# Altium schematic sheet J-Link ARM-OB.SchDoc
size A4; DocumentNumber: 2; SheetNumber: 2; SheetTotal: 2
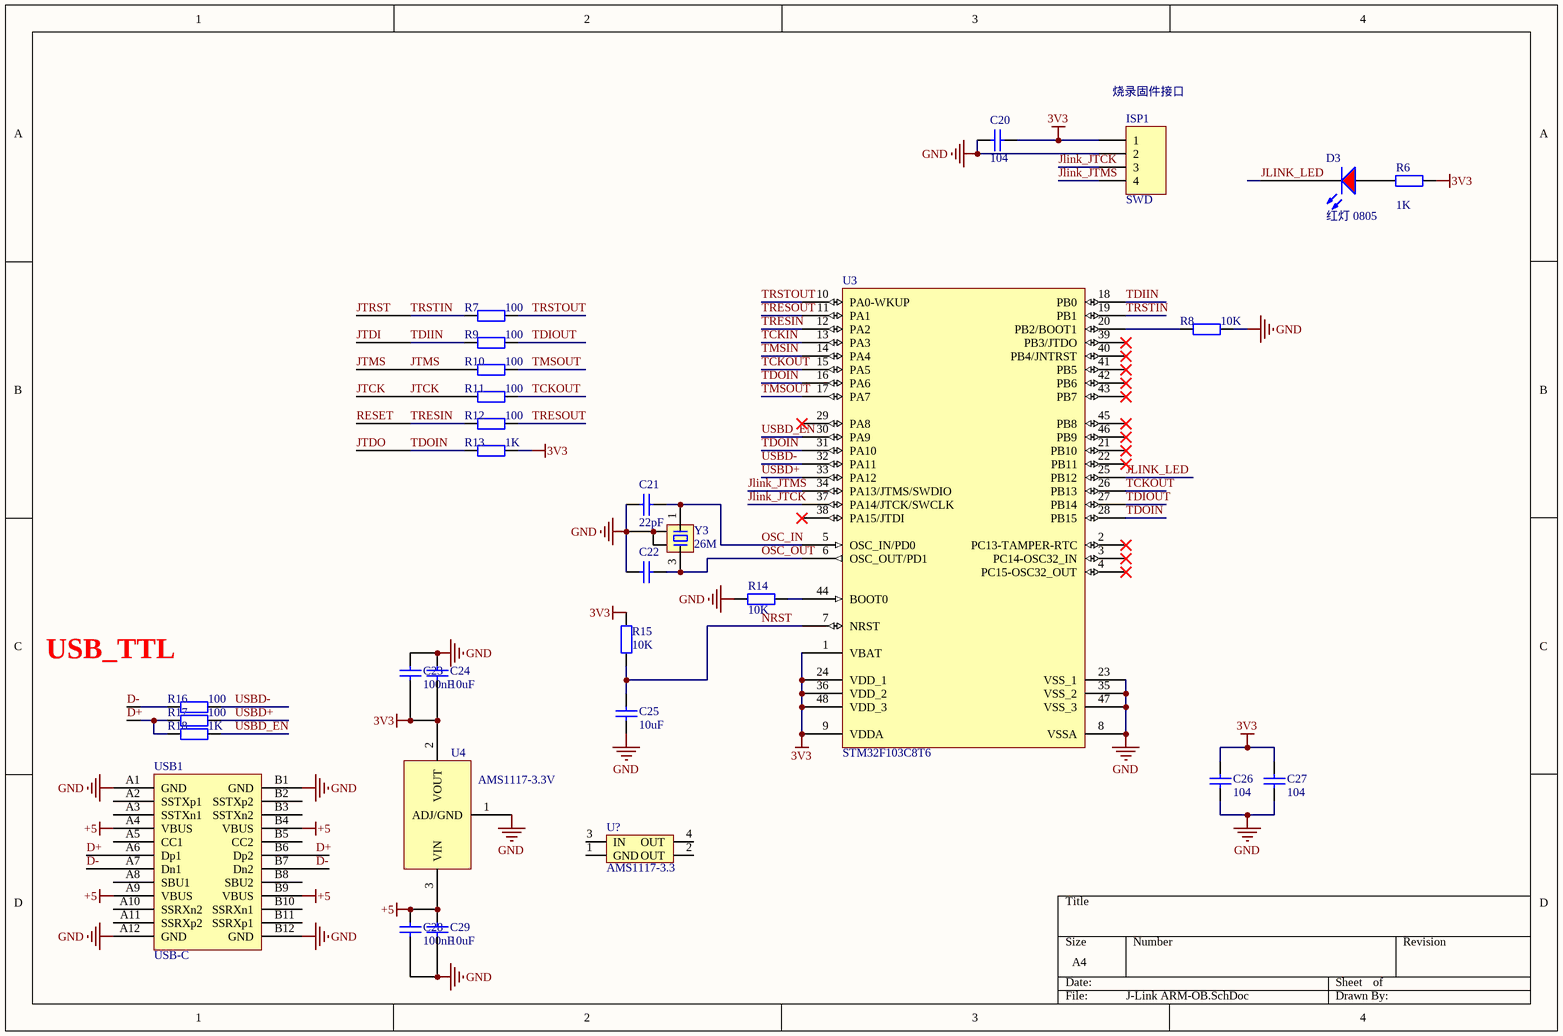
[diagram p0: J-Link ARM-OB.SchDoc]

## Parts
C20  value 104  [LC-0805_C]
C21  value 22pF  [LC-0805_C]
C22  (no value)  [LC-0805_C]
C23  100nF  [LC-0805_C]
C24  10uF  [LC-0805_C]
C25  value 10uF  [LC-0805_C]
C26  value 104  [LC-0805_C]
C27  value 104  [LC-0805_C]
C28  100nF  [LC-0805_C]
C29  10uF  [LC-0805_C]
D3  红灯 0805  [LC-0805_LED_S1]
ISP1  SWD  [HDR1X4]
R6  value 1K  [LC-0805_L]
R7  value 100  [LC-0805_L]
R8  value 10K  [LC-0805_L]
R9  value 100  [LC-0805_L]
R10  value 100  [LC-0805_L]
R11  value 100  [LC-0805_L]
R12  value 100  [LC-0805_L]
R13  value 1K  [LC-0805_L]
R14  value 10K  [LC-0805_L]
R15  value 10K  [LC-0805_L]
R16  value 100  [LC-0805_L]
R17  value 100  [LC-0805_L]
R18  value 1K  [LC-0805_L]
U3  STM32F103C8T6  [LQFP48 7X7_N]
U4  AMS1117-3.3V  [SOT-223]
U?  AMS1117-3.3  [AMS1117]
USB1  USB-C  [USB-C/S_A]
Y3  26M  [XTAL-3225]

## Nets
3V3: C20.2 C23.1 C24.1 C26.1 C27.1 ISP1.1 R6.2 R13.2 R15.2 U3.1(VBAT) U3.9(VDDA) U3.24(VDD_1) U3.36(VDD_2) U3.48(VDD_3) U4.2(VOUT)
+5: C28.2 C29.2 U4.3(VIN) USB1.A4(VBUS) USB1.A9(VBUS) USB1.B4(VBUS) USB1.B9(VBUS)
GND: C20.1 C21.2 C22.2 C23.2 C24.2 C25.2 C26.2 C27.2 C28.1 C29.1 ISP1.2 R8.2 R14.1 U3.8(VSSA) U3.23(VSS_1) U3.35(VSS_2) U3.47(VSS_3) U4.1(ADJ/GND) USB1.A1(GND) USB1.A12(GND) USB1.B1(GND) USB1.B12(GND) Y3.2 Y3.4
D+: R17.1 R18.1 USB1.A6(Dp1) USB1.B6(Dp2)
D-: R16.1 USB1.A7(Dn1) USB1.B7(Dn2)
Jlink_JTCK: ISP1.3 U3.37(PA14/JTCK/SWCLK)
Jlink_JTMS: ISP1.4 U3.34(PA13/JTMS/SWDIO)
JLINK_LED: D3.K U3.25(PB12)
JTCK: R11.1
JTDI: R9.1 U3.18(PB0)  [also labelled TDIIN]
JTDO: R13.1 U3.16(PA6) U3.28(PB15) U3.31(PA10)  [also labelled TDOIN]
JTMS: R10.1
JTRST: R7.1 U3.19(PB1)  [also labelled TRSTIN]
NRST: C25.1 R15.1 U3.7(NRST)
OSC_IN: C21.1 U3.5(OSC_IN/PD0) Y3.1
OSC_OUT: C22.1 U3.6(OSC_OUT/PD1) Y3.3
RESET: R12.1 U3.12(PA2)  [also labelled TRESIN]
TCKIN: U3.13(PA3)
TCKOUT: R11.2 U3.15(PA5) U3.26(PB13)
TDIOUT: R9.2 U3.27(PB14)
TMSIN: U3.14(PA4)
TMSOUT: R10.2 U3.17(PA7)
TRESOUT: R12.2 U3.11(PA1)
TRSTOUT: R7.2 U3.10(PA0-WKUP)
USBD+: R17.2 U3.33(PA12)
USBD-: R16.2 U3.32(PA11)
USBD_EN: R18.2 U3.30(PA9)
NetD3_A: D3.A R6.1
NetR8_1: R8.1 U3.20(PB2/BOOT1)
NetR14_2: R14.2 U3.44(BOOT0)

Not connected (* = marked no-connect by the designer): U3 2(PC13-TAMPER-RTC)* 3(PC14-OSC32_IN)* 4(PC15-OSC32_OUT)* 21(PB10)* 22(PB11)* 29(PA8)* 38(PA15/JTDI)* 39(PB3/JTDO)* 40(PB4/JNTRST)* 41(PB5)* 42(PB6)* 43(PB7)* 45(PB8)* 46(PB9)*; U? 1(GND) 2(OUT) 3(IN) 4(OUT); USB1 A2(SSTXp1) A3(SSTXn1) A5(CC1) A8(SBU1) A10(SSRXn2) A11(SSRXp2) B2(SSTXp2) B3(SSTXn2) B5(CC2) B8(SBU2) B10(SSRXn1) B11(SSRXp1)

## Notes on the sheet
- (near ISP1) 烧录固件接口
- USB_TTL

## Library data of the parts
C20-C22 C25-C27 = Cap: Capacitor; Published: 8-Jun-2000; LatestRevisionDate: 17-Jul-2002; LatestRevisionNote: Re-released for DXP Platform.; PackageReference: RAD-0.3; Publisher: Altium Limited
C23 C28 = 0805 100nF(104) 10% 50V: 贴片电容; ComponentLink1Description: 供应商链接; ComponentLink1URL: http://www.szlcsc.com/product/details_50686.html; Package: 0805; Supplier: LC; SuppliersPartNumber: C49678
C24 C29 = 0805 10uF (106) 10% 25V: 贴片电容; ComponentLink1Description: 供应商链接; ComponentLink1URL: http://www.szlcsc.com/product/details_16532.html; Package: 0805; Supplier: LC; SuppliersPartNumber: C15850
D3 = 0805 红灯: 发光二极管; ComponentLink1Description: 供应商链接; ComponentLink1URL: http://www.szlcsc.com/product/details_2668.html; Package: 0805; Supplier: LC; SuppliersPartNumber: C2295
ISP1 = Header 4: Header, 4-Pin; LatestRevisionDate: 17-Jul-2002; LatestRevisionNote: Re-released for DXP Platform.; Publisher: Altium Limited
R6-R18 = Res2: Resistor; Published: 8-Jun-2000; LatestRevisionDate: 17-Jul-2002; LatestRevisionNote: Re-released for DXP Platform.; PackageReference: AXIAL-0.4; Publisher: Altium Limited
U3 = STM32F103C8T6: STM32 ARM-based 32-bit MCU with 64 Kbytes Flash, 48-pin LQFP, Industrial Temperature; Published: 30-May-2008; DatasheetVersion: rev6, Mar-2008; PackageVersion: Mar-2008; PackageReference: LQFP48; Publisher: Altium Limited; PackageDescription: 48-Pin Low-Profile Quad Flat Pack, 7 x 7 mm Body, 0.5 mm Pitch (LQFP48); ComponentLink1Description: Manufacturer Link; ComponentLink1URL: www.st.com/stm32; ComponentLink2Description: Datasheet; ComponentLink2URL: http://www.st.com/stonline/products/literature/ds/13587.pdf
U? = AMS1117
USB1 = USB-C/S: USB-C型母接口; 版权归属: 黎明电子style; BOM名称: USB-C型母接口; 学习资源: https://lmdzstyle.taobao.com/
Y3 = XTAL-4: 4脚晶振; 版权归属: 黎明电子style; BOM名称: 4脚晶振; 学习资源: https://lmdzstyle.taobao.com/